# EAGLE design XC9536_trainer (EAGLE 7.1.0)
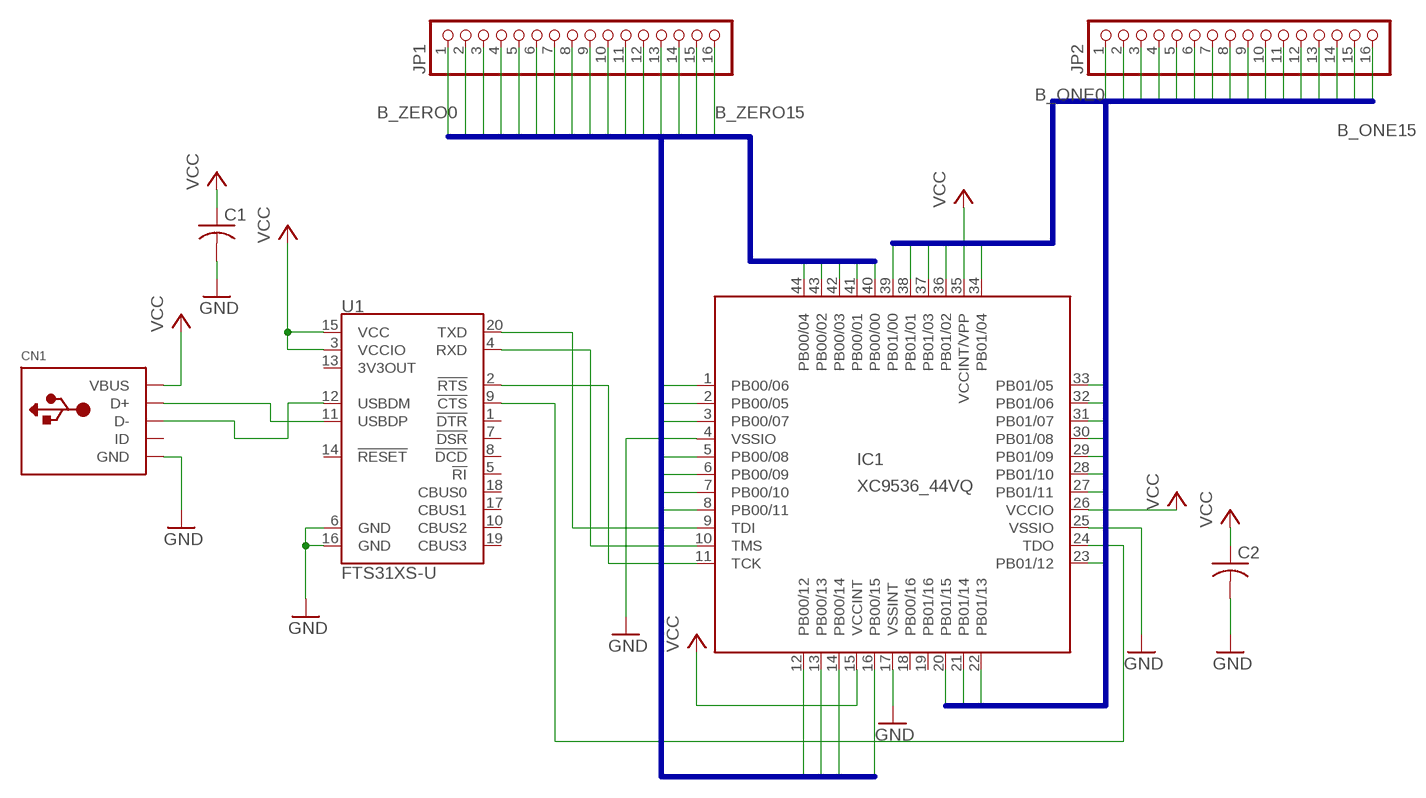
[diagram p0: schematic, sheet 1]

## Parts
C1  C-USC0603K  [C0603K]
C2  C-USC0603K  [C0603K]
CN1  USBMINIBLARGE  [USB-MINIB_LARGER]
IC1  XC9536_44VQ  [SQFP-S-10X10-44]
JP1  HEADER-1X16ROUND  [1X16_ROUND]
JP2  HEADER-1X16ROUND  [1X16_ROUND]
U1  FTS31XS-U  FT231XS  [SSOP20_L]

## Nets
B_ONE0: IC1.39(PB01/00) JP2.1
B_ONE1: IC1.38(PB01/01) JP2.2
B_ONE2: IC1.36(PB01/02) JP2.3
B_ONE3: IC1.37(PB01/03) JP2.4
B_ONE4: IC1.34(PB01/04) JP2.5
B_ONE5: IC1.33(PB01/05) JP2.6
B_ONE6: IC1.32(PB01/06) JP2.7
B_ONE7: IC1.31(PB01/07) JP2.8
B_ONE8: IC1.30(PB01/08) JP2.9
B_ONE9: IC1.29(PB01/09) JP2.10
B_ONE10: IC1.28(PB01/10) JP2.11
B_ONE11: IC1.27(PB01/11) JP2.12
B_ONE12: IC1.23(PB01/12) JP2.13
B_ONE13: IC1.22(PB01/13) JP2.14
B_ONE14: IC1.21(PB01/14) JP2.15
B_ONE15: IC1.20(PB01/15) JP2.16
B_ZERO0: IC1.40(PB00/00) JP1.1
B_ZERO1: IC1.41(PB00/01) JP1.2
B_ZERO2: IC1.43(PB00/02) JP1.3
B_ZERO3: IC1.42(PB00/03) JP1.4
B_ZERO4: IC1.44(PB00/04) JP1.5
B_ZERO5: IC1.2(PB00/05) JP1.6
B_ZERO6: IC1.1(PB00/06) JP1.7
B_ZERO7: IC1.3(PB00/07) JP1.8
B_ZERO8: IC1.5(PB00/08) JP1.9
B_ZERO9: IC1.6(PB00/09) JP1.10
B_ZERO10: IC1.7(PB00/10) JP1.11
B_ZERO11: IC1.8(PB00/11) JP1.12
B_ZERO12: IC1.12(PB00/12) JP1.13
B_ZERO13: IC1.13(PB00/13) JP1.14
B_ZERO14: IC1.14(PB00/14) JP1.15
B_ZERO15: IC1.16(PB00/15) JP1.16
GND: C1.2 C2.2 CN1.GND IC1.4(VSSIO) IC1.17(VSSINT) IC1.25(VSSIO) U1.6(GND) U1.16(GND)
N$1: CN1.D+ U1.11(USBDP)
N$2: CN1.D- U1.12(USBDM)
N$4: IC1.9(TDI) U1.20(TXD)
N$5: IC1.10(TMS) U1.4(RXD)
N$6: IC1.11(TCK) U1.2(!RTS)
N$7: IC1.24(TDO) U1.9(!CTS)
VCC: C1.1 C2.1 CN1.VBUS IC1.15(VCCINT) IC1.26(VCCIO) IC1.35(VCCINT/VPP) U1.3(VCCIO) U1.15(VCC)
Unconnected: CN1.ID IC1.18(PB00/16) IC1.19(PB01/16) U1.1(!DTR) U1.5(!RI) U1.7(!DSR) U1.8(!DCD) U1.10(CBUS2) U1.13(3V3OUT) U1.14(!RESET) U1.17(CBUS1) U1.18(CBUS0) U1.19(CBUS3)

## Buses
B_ZERO[0..15]
B_ONE[0..15]

## Library data of the parts
C1 C2 = rcl:C-US: CAPACITOR, American symbol
CN1 = OLED_mod:USB: USB Connectors USBMINIB - Surface Mount Female Mini-B USB Connector 4UConnector: 06564
IC1 = xilinx-xc9:XC9536_44VQ: xc9536_pc44 XC9500 In-System Programmable CPLD Family Auto generated by make-symbol-device-package-bsdl.ulp Rev. 34 Source: xc9536_vq44.bsd; MPN: XC9536-15VQG44C; OC_FARNELL: 1193227; OC_NEWARK: 98K3377
JP1 JP2 = OLED_mod:HEADER-1X16: PIN HEADER
U1 = SparkFun-DigitalIC:FT231X: FTDI FT231X Full Speed USB to Full-handshake UART This USB2.0 Full Speed IC offers a compact bridge to full handshake UART interfaces. The device is a UART, capable of operating up to 3MBaud, with low power consumption (8mA). The FT231X includes the complete FT-X series feature set and enables USB to be added into a system design quickly and easily over a UART interface.; PROD_ID: IC-11524

## Board
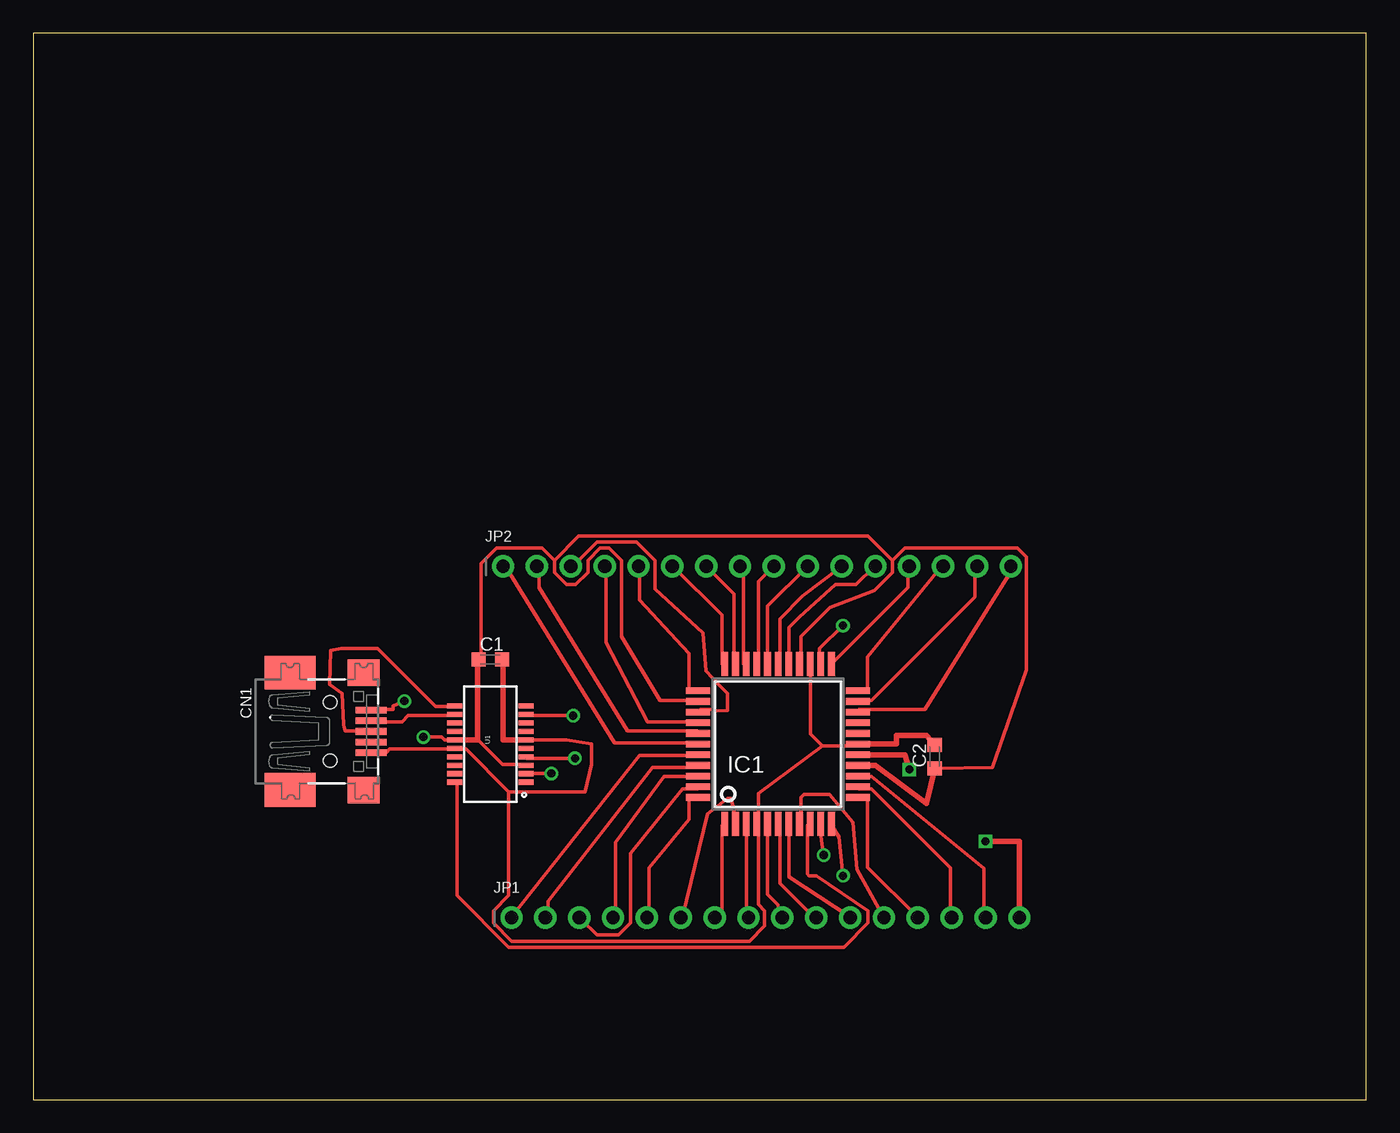
[diagram p1: board, top side]
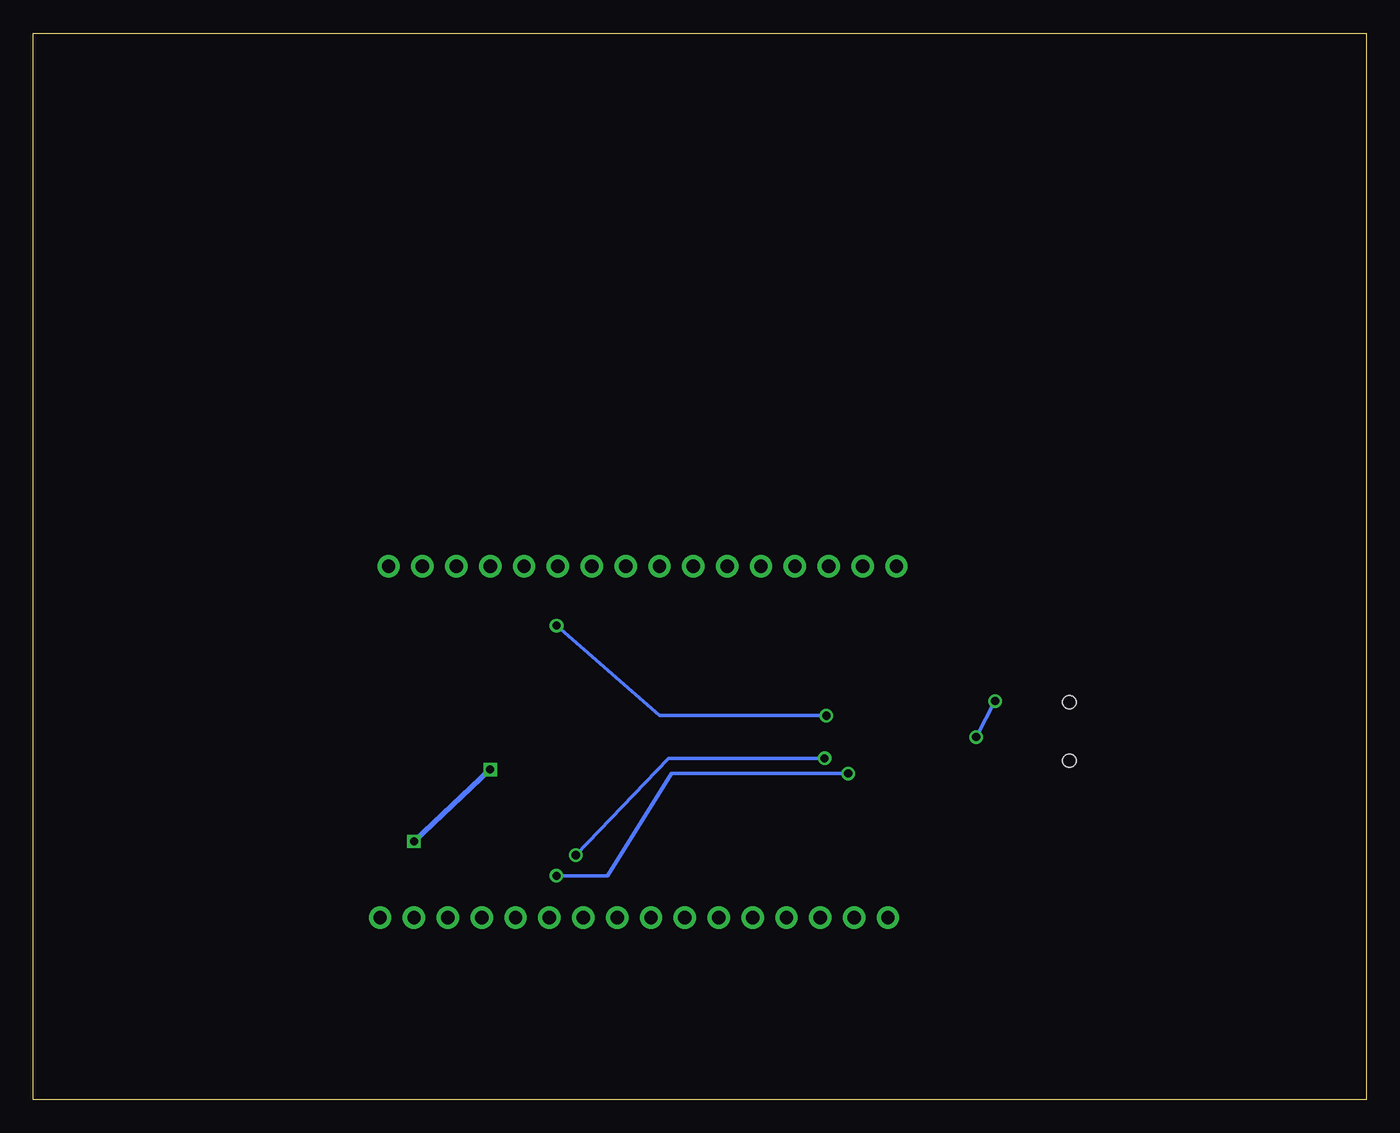
[diagram p2: board, bottom side, seen from below]

Size 100 x 80 mm. Coordinates in mm from the lower left corner, seen from the top.
Outline: 0,0 100,0 100,80 0,80 0,0
Copper layers (1*16): Top 0.035mm / dielectric 1.5mm / Bottom 0.035mm
Design rules "default": minimum track width 10mil, minimum drill 24mil, track to track 8mil, track to pad 8mil, pad to pad 8mil, via to via 8mil, smd to smd 8mil, copper to edge 40mil, drill to drill 8mil, minimum pad ring 10mil, minimum via ring 8mil, stop-mask expansion 4mil, vias tented up to drill 0mil, thermal gap 10mil
vRestrict: area 32.4,22.2 to 36.2,31.1; area 50.8,21.6 to 61,31.8

### Footprints (pad centres in the part's own frame; a part is rotated, then mirrored left to right if it is on the bottom)
C0603K = smd 1.05 x 1.08: 1 -0.875,0; 2 0.875,0
USB-MINIB_LARGER = smd 0.5 x 2.308: D+ 0,4.064; D- -0.8,4.064; GND 1.6,4.064; ID 0.8,4.064; VBUS -1.6,4.064 | smd 2.54 x 3.81: GND1 -4.4,-2; GND4 4.4,-2 | smd 2 x 2.4: GND2 -4.4,3.5; GND3 4.4,3.5 | hole 1: -2.2,1; 2.2,1
SQFP-S-10X10-44 = smd 0.5 x 1.8: 1 -4,-6; 2 -3.2,-6; 3 -2.4,-6; 4 -1.6,-6; 5 -0.8,-6; 6 0,-6; 7 0.8,-6; 8 1.6,-6; 9 2.4,-6; 10 3.2,-6; 11 4,-6; 23 4,6; 24 3.2,6; 25 2.4,6; 26 1.6,6; 27 0.8,6; 28 0,6; 29 -0.8,6; 30 -1.6,6; 31 -2.4,6; 32 -3.2,6; 33 -4,6 | smd 1.8 x 0.5: 12 6,-4; 13 6,-3.2; 14 6,-2.4; 15 6,-1.6; 16 6,-0.8; 17 6,0; 18 6,0.8; 19 6,1.6; 20 6,2.4; 21 6,3.2; 22 6,4; 34 -6,4; 35 -6,3.2; 36 -6,2.4; 37 -6,1.6; 38 -6,0.8; 39 -6,0; 40 -6,-0.8; 41 -6,-1.6; 42 -6,-2.4; 43 -6,-3.2; 44 -6,-4
1X16_ROUND = drill 1 pad 1.676: 1 -19.05,0; 2 -16.51,0; 3 -13.97,0; 4 -11.43,0; 5 -8.89,0; 6 -6.35,0; 7 -3.81,0; 8 -1.27,0; 9 1.27,0; 10 3.81,0; 11 6.35,0; 12 8.89,0; 13 11.43,0; 14 13.97,0; 15 16.51,0; 16 19.05,0
SSOP20_L = smd 0.381 x 1.143: 1 -2.857,-2.68; 2 -2.223,-2.68; 3 -1.587,-2.68; 4 -0.953,-2.68; 5 -0.318,-2.68; 6 0.318,-2.68; 7 0.953,-2.68; 8 1.587,-2.68; 9 2.223,-2.68; 10 2.857,-2.68; 11 2.857,2.68; 12 2.223,2.68; 13 1.587,2.68; 14 0.953,2.68; 15 0.318,2.68; 16 -0.318,2.68; 17 -0.953,2.68; 18 -1.587,2.68; 19 -2.223,2.68; 20 -2.857,2.68

### Placement (x,y rotation side)
C1  34.29,33.02 0 top
C2  67.63,25.72 90 top
CN1  21.27,27.62 270 top
IC1  55.88,26.67 0 top
JP1  54.93,13.65 0 top
JP2  54.29,40.01 0 top
U1  34.29,26.67 90 top

### Tracks (layer width: path | path; a pad name or v marks a point on that pad's centre or on a via)
B_ONE0
  Top 0.254: IC1.39 49.84,26.75 43.61,26.75 35.43,40.01 JP2.1
B_ONE1
  Top 0.254: IC1.38 49.84,27.66 44.56,27.66 37.95,38.41 37.95,40.01 JP2.2
B_ONE2
  Top 0.254: IC1.36 50.06,29.26 50.98,29.26 51.21,29.17 52.07,29.21 52.07,30.48 51.44,31.11 50.48,32.14 50.25,35 46.63,38.3 46.63,40.46 45.26,41.83 42.29,41.83 40.46,40.01 JP2.3
B_ONE3
  Top 0.254: IC1.37 49.84,28.35 46.06,28.35 42.98,34.29 42.98,40.01 JP2.4
B_ONE4
  Top 0.254: IC1.34 49.2,30.54 49.2,33.47 45.49,37.49 45.49,40.01 JP2.5
B_ONE5
  Top 0.254: IC1.33 51.66,32.69 51.66,36.35 48.01,40.01 JP2.6
B_ONE6
  Top 0.254: IC1.32 52.58,32.69 52.58,37.95 50.52,40.01 JP2.7
B_ONE7
  Top 0.254: IC1.31 53.26,32.69 53.26,39.78 53.03,40.01 JP2.8
B_ONE8
  Top 0.254: IC1.30 54.41,32.69 54.41,38.86 JP2.9
B_ONE9
  Top 0.254: IC1.29 55.09,32.69 55.09,37.03 58.06,40.01 JP2.10
B_ONE10
  Top 0.254: IC1.28 56.01,32.69 56.01,36.07 57.72,37.78 JP2.11
B_ONE11
  Top 0.254: IC1.27 56.69,32.69 56.69,34.52 56.69,35.42 57.47,36.2 60.17,38.63 61.72,38.63 63.09,40.01 JP2.12
B_ONE12
  Top 0.254: IC1.23 59.89,32.69 65.61,38.42 65.61,40.01 JP2.13
B_ONE13
  Top 0.254: IC1.22 62.59,30.54 62.59,33.2 68.12,40.01 JP2.14
B_ONE14
  Top 0.254: IC1.21 61.95,29.95 62.87,29.95 70.64,37.72 70.64,40.01 JP2.15
B_ONE15
  Top 0.254: IC1.20 61.95,29.26 66.9,29.26 73.15,39.32 73.15,40.01 JP2.16
B_ZERO0
  Top 0.254: IC1.40 49.84,25.83 45.47,25.83 35.89,13.72 JP1.1
B_ZERO1
  Top 0.254: IC1.41 49.84,24.92 46.47,24.92 38.63,14.86 38.63,13.72 JP1.2
B_ZERO2
  Top 0.254: IC1.43 49.84,23.32 48.69,23.32 44.81,18.48 44.81,13.26 43.89,12.34 42.29,12.34 41.15,13.49 JP1.3
B_ZERO3
  Top 0.254: IC1.42 49.84,24.23 47.33,24.23 43.66,19.29 43.66,13.72 JP1.4
B_ZERO4
  Top 0.254: IC1.44 49.2,22.63 49.2,21.03 46.18,17.37 46.18,13.72 JP1.5
B_ZERO5
  Top 0.254: IC1.2 52.58,20.8 52.58,21.72 52.35,22.58 52.07,22.58 50.6,21.43 48.69,13.72 JP1.6
B_ZERO6
  Top 0.254: IC1.1 51.66,20.57 51.66,14.17 51.21,13.72 JP1.7
B_ZERO7
  Top 0.254: IC1.3 53.49,20.57 53.49,13.72 JP1.8
B_ZERO8
  Top 0.254: IC1.5 55.09,20.57 55.09,15.39 55.88,14.61 56.01,13.72 JP1.9
B_ZERO9
  Top 0.254: IC1.6 56.01,20.57 56.01,16.23 58.52,13.72 JP1.10
B_ZERO10
  Top 0.254: IC1.7 56.69,20.57 56.69,16.7 61.27,13.72 JP1.11
B_ZERO11
  Top 0.254: IC1.8 57.61,20.8 57.61,22.67 57.84,22.9 59.72,22.9 61.49,20.8 61.81,17.27 63.78,13.72 JP1.12
B_ZERO12
  Top 0.254: JP1.13 62.59,17.42 62.59,22.63 IC1.12
B_ZERO13
  Top 0.254: IC1.13 61.95,23.32 62.87,23.32 68.81,17.37 68.81,13.72 JP1.14
B_ZERO14
  Top 0.254: IC1.14 61.95,24.23 62.87,24.23 71.32,17.36 71.32,13.72 JP1.15
B_ZERO15  (via drill 0.6)
  Top 0.406: IC1.16 65.41,25.87 v65.72,24.77 | v71.44,19.37 73.98,19.37 JP1.16
  Bottom 0.406: v65.72,24.77 v71.44,19.37
GND
  Top 0.254: CN1.GND 25.38,26.06 26.52,26.06 26.75,26.29 31.55,26.29 U1.16 31.77,26.29 32.46,26.29 35.66,23.09 | 35.66,23.09 41.4,23.09 41.87,25.15 41.87,26.7 40.01,26.98 37.03,26.98 U1.6 | 59.21,26.52 54.41,22.99 54.41,20.8 IC1.4 54.41,20.57 54.41,14.63 54.86,14.17 54.86,13.03 53.72,11.89 35.89,11.89 34.52,13.26 34.52,14.17 35.66,15.32 35.66,23.09 | 59.21,26.52 61.72,26.52 IC1.17 | 59.21,26.52 58.29,27.43 58.29,32.46 IC1.25
  Top 0.406: C1.2 35.24,33.02 35.24,26.99 U1.6 | IC1.17 64.77,26.67 64.77,27.3 66.99,27.3 C2.2
N$1
  Top 0.254: U1.11 31.55,29.49 30.18,29.49 25.83,33.83 23.09,33.83 22.31,33.69 22.23,31.15 23.18,30.48 23.27,28.09 23.38,27.66 25.15,27.66 CN1.D+
N$2
  Top 0.254: U1.12 31.55,28.8 28.12,28.8 27.66,28.35 25.38,28.35 CN1.D-
N$4
  Top 0.254: U1.20 31.77,23.77 31.77,15.32 35.66,11.43 60.81,11.43 62.64,13.26 62.64,14.17 58.75,16.79 58.2,16.79 58.06,16.93 58.06,20.57 IC1.9
N$5  (via drill 0.61)
  Top 0.254: v40.64,25.6 37.03,25.6 U1.4 | v59.3,18.34 58.98,20.57 IC1.10
  Bottom 0.254: v40.64,25.6 52.35,25.6 v59.3,18.34
N$6  (via drill 0.61)
  Top 0.254: v38.86,24.46 37.03,24.46 U1.2 | v60.76,16.79 60.44,19.71 59.89,20.57 IC1.11
  Bottom 0.254: v38.86,24.46 52.12,24.46 56.93,16.79 v60.76,16.79
N$7  (via drill 0.61)
  Top 0.254: v40.5,28.8 37.03,28.8 U1.9 | v60.74,35.56 58.98,33.83 58.98,32.69 IC1.24
  Bottom 0.254: v40.5,28.8 53.03,28.8 v60.74,35.56
VCC  (via drill 0.61)
  Top 0.254: U1.3 36.8,25.15 35.2,25.15 33.38,26.98 33.34,26.99 | 39.09,40.46 39.09,39.55 40.01,38.63 40.69,38.63 41.6,39.55 41.6,40.46 42.52,41.38 43.2,41.38 44.12,40.46 44.12,34.75 47.02,29.95 49.84,29.95 IC1.35 | 39.09,40.46 38.18,41.38 34.75,41.38 33.6,40.23 33.6,33.15 C1.1 | 64.47,40.46 64.47,39.55 63.09,38.18 59.77,36.91 57.61,34.75 57.61,32.69 IC1.26 | 64.47,40.46 62.64,42.29 40.92,42.29 39.09,40.46 | v27.84,29.9 26.99,29.53 26.99,29.26 25.38,29.26 CN1.VBUS | v29.26,27.2 30.63,27.2 30.86,26.98 31.55,26.98 U1.15 | 64.47,40.46 65.38,41.38 73.84,41.38 74.52,40.69 74.52,32.23 71.97,24.92 C2.1
  Top 0.406: C1.1 33.34,33.02 33.34,26.99 U1.15 | IC1.15 63.18,25.08 66.99,22.21 C2.1 67.63,24.75
  Bottom 0.254: v29.26,27.2 v27.84,29.9